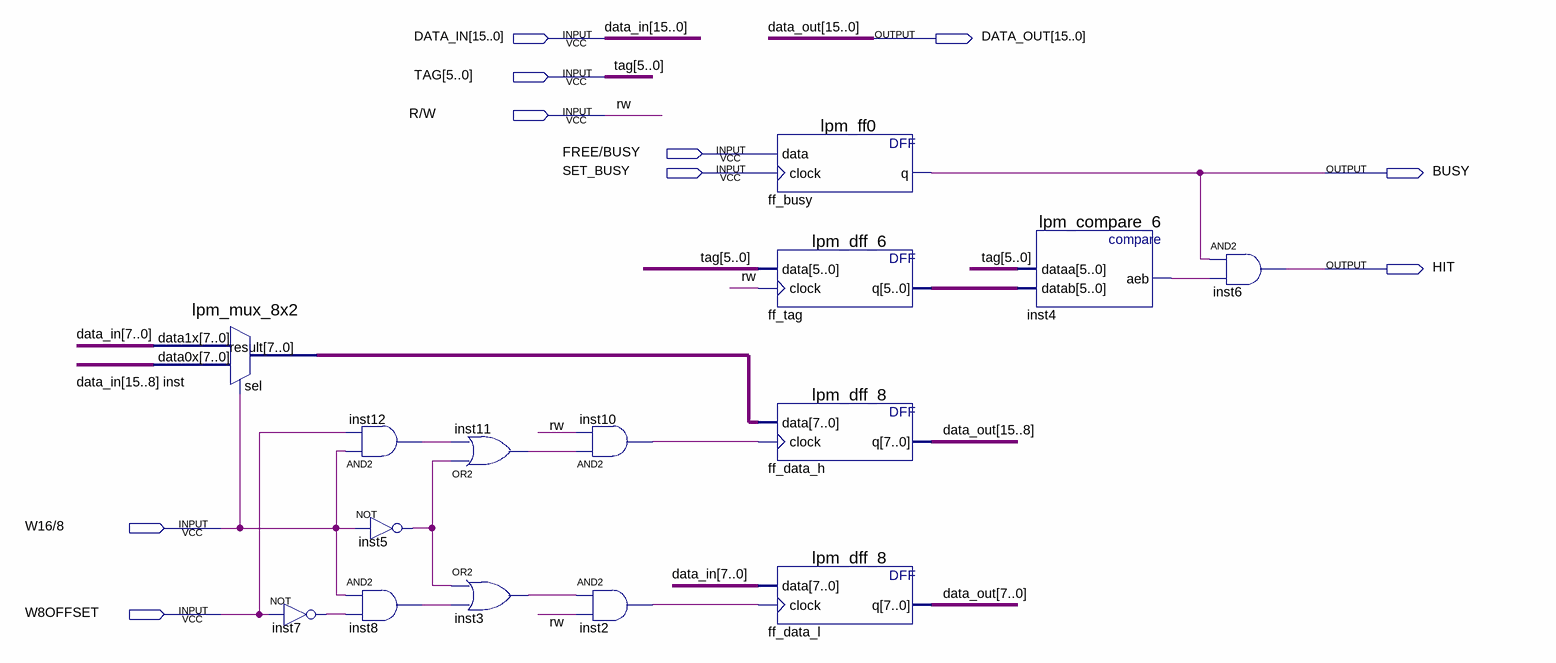
[diagram p0: schematic sheet]
// Quartus schematic device-cache-line.bdf as structural Verilog: 15 symbols, 10 pins
module \device-cache-line  (
  input  [15:0] DATA_IN,
  input  [5:0] TAG,
  input  \R/W ,
  input  \FREE/BUSY ,
  input  SET_BUSY,
  input  \W16/8 ,
  input  W8OFFSET,
  output [15:0] DATA_OUT,
  output BUSY,
  output HIT
);

  wire inst2_out, inst3_out, inst4_aeb, inst5_out, inst7_out, inst8_out, inst10_out, inst11_out, inst12_out;
  wire [5:0] ff_tag_q;
  wire [7:0] inst_result;

  lpm_mux_8x2 inst (.data1x(DATA_IN[7:0]), .data0x(DATA_IN[15:8]), .sel(\W16/8 ), .result(inst_result));
  not inst7 (inst7_out, W8OFFSET);
  and inst12 (inst12_out, \W16/8 , W8OFFSET);
  not inst5 (inst5_out, \W16/8 );
  and inst8 (inst8_out, \W16/8 , inst7_out);
  or inst11 (inst11_out, inst5_out, inst12_out);
  or inst3 (inst3_out, inst5_out, inst8_out);
  and inst10 (inst10_out, inst11_out, \R/W );
  and inst2 (inst2_out, inst3_out, \R/W );
  lpm_ff0 ff_busy (.data(\FREE/BUSY ), .clock(SET_BUSY), .q(BUSY));
  lpm_dff_6 ff_tag (.data(TAG), .clock(\R/W ), .q(ff_tag_q));
  lpm_dff_8 ff_data_h (.data(inst_result), .clock(inst10_out), .q(DATA_OUT[15:8]));
  lpm_dff_8 ff_data_l (.data(DATA_IN[7:0]), .clock(inst2_out), .q(DATA_OUT[7:0]));
  lpm_compare_6 inst4 (.dataa(TAG), .datab(ff_tag_q), .aeb(inst4_aeb));
  and inst6 (HIT, BUSY, inst4_aeb);

  // Other names for the same wires on the sheet: rw = \R/W 
endmodule
